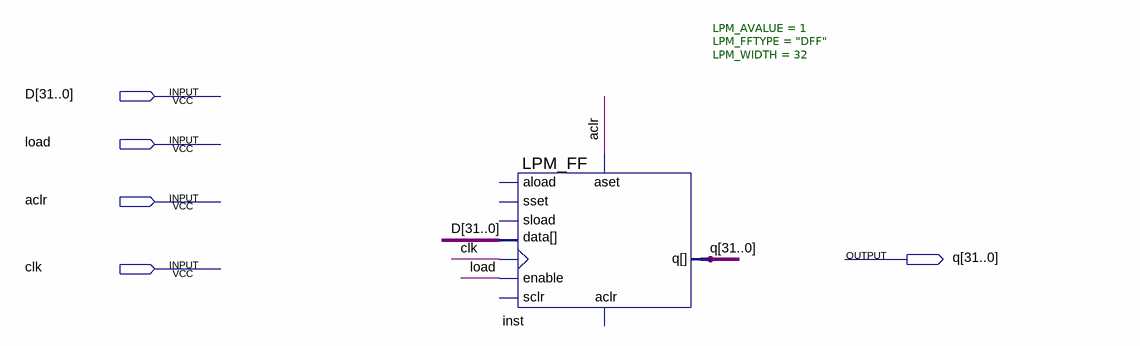
[diagram p0: schematic sheet]
// Quartus schematic r5.bdf as structural Verilog: 1 symbols, 5 pins
module r5 (
  input  [31:0] D,
  input  load,
  input  aclr,
  input  clk,
  output [31:0] q
);

  LPM_FF #(.LPM_AVALUE(1), .LPM_FFTYPE("DFF"), .LPM_WIDTH(32)) inst (
    .enable(load), .clock(clk), .aset(aclr), .data(D), .q(q));  // open: aload, sset, sload, sclr, aclr
endmodule
